# Altium schematic sheet SDEC944-xD_R‚serves_(ETOR).SchDoc: Réserves (ETOR)
size 393 x 270 mm; CompanyName: Seccom; Address1: 521, rue du capt. François Garbit; Address2: 69440 Mornant; Address3: seccom@seccom.fr; Address4: www.seccom.fr; DocumentNumber: 20; SheetNumber: 20; SheetTotal: 22; PageSetup: Record=PageOptions|CenterHorizontal=True|CenterVertical=True|PrintScale=0.74|XCorrection=1.00|YCorrection=1.00|PrintKind=0|BorderSize=5000000|LeftOffset=0|BottomOffset=0|Orientation=2|PaperLength=1000|PaperWidth=1000|Scale=100|PaperSource=7|PrintQuality=-4|MediaType=1|DitherType=10|PaperKind=A4|PrintScaleMode=1
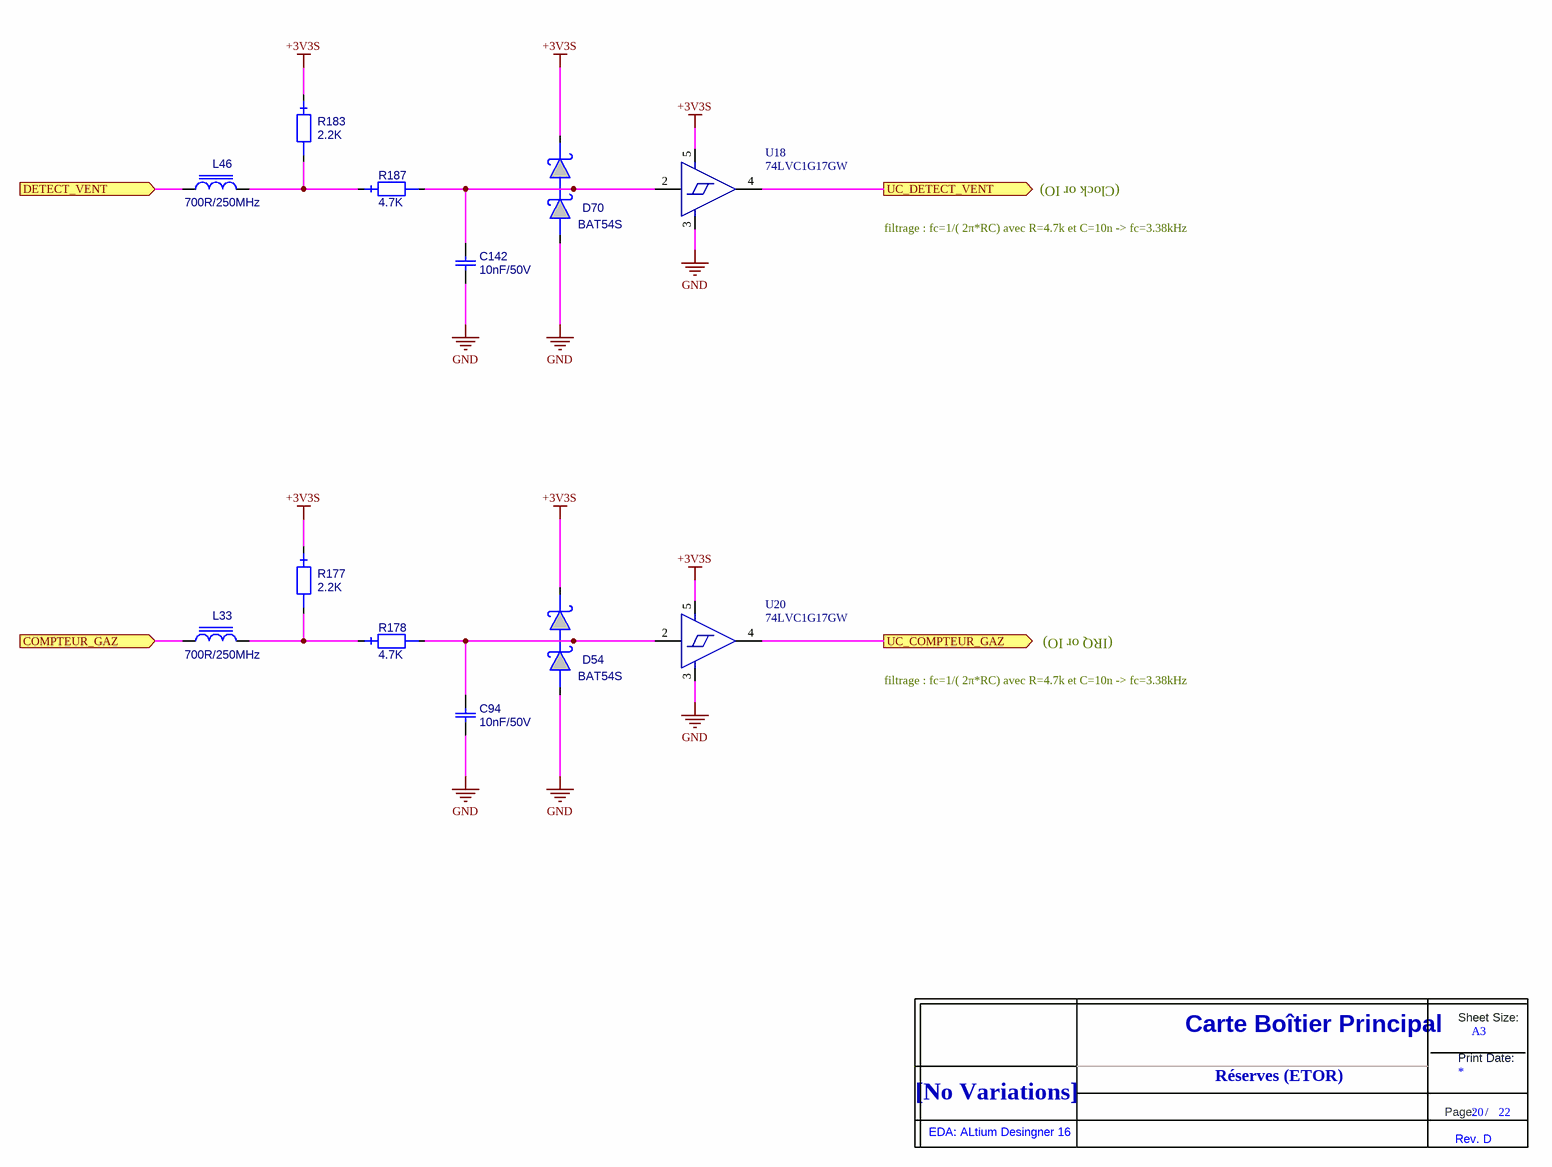
[diagram p0: SDEC944-xD_R‚serves_(ETOR).SchDoc]

## Parts
C94  value 10nF/50V  [0603_ReflowSoldering_CAP]  (hidden comment: C_0603_X7R_10%_10N-50V)
C142  value 10nF/50V  [0603_ReflowSoldering_CAP]  (hidden comment: C_0603_X7R_10%_10N-50V)
D54  BAT54S  [SOT23_3L_ReflowSoldering]
D70  BAT54S  [SOT23_3L_ReflowSoldering]
L33  value 700R/250MHz  [0603_ReflowSoldering_CAP]  (hidden comment: IND_FERRITE_0603_742792643)
L46  value 700R/250MHz  [0603_ReflowSoldering_CAP]  (hidden comment: IND_FERRITE_0603_742792643)
R177  value 2.2K  [0603_ReflowSoldering_RES]  (hidden comment: RES_0603_1%_100PPM_2.2K)
R178  value 4.7K  [0603_ReflowSoldering_RES]  (hidden comment: RES_0603_1%_100PPM_4.7K)
R183  value 2.2K  [0603_ReflowSoldering_RES]  (hidden comment: RES_0603_1%_100PPM_2.2K)
R187  value 4.7K  [0603_ReflowSoldering_RES]  (hidden comment: RES_0603_1%_100PPM_4.7K)
Title_new  DNI  (value not drawn)  (graphical)
U18  74LVC1G17GW  [SOT353]
U20  74LVC1G17GW  [SOT353]

## Ports
COMPTEUR_GAZ (in), DETECT_VENT (in), UC_COMPTEUR_GAZ (out), UC_DETECT_VENT (out)

## Nets
+3V3S: D54.2 D70.2 R177.1 R183.1 U18.5(VCC) U20.5(VCC)
GND: C94.1 C142.1 D54.1 D70.1 U18.3(VCC) U20.3(VCC)
COMPTEUR_GAZ: L33.1 ; port COMPTEUR_GAZ
DETECT_VENT: L46.1 ; port DETECT_VENT
UC_COMPTEUR_GAZ: U20.4(Y) ; port UC_COMPTEUR_GAZ
UC_DETECT_VENT: U18.4(Y) ; port UC_DETECT_VENT
NetC94_2: C94.2 D54.3 R178.2 U20.2(A)
NetC142_2: C142.2 D70.3 R187.2 U18.2(A)
NetL33_2: L33.2 R177.2 R178.1
NetL46_2: L46.2 R183.2 R187.1

Not connected (* = marked no-connect by the designer): U18 1(NC); U20 1(NC)

## Notes on the sheet
- (Clock or IO)
- filtrage : fc=1/( 2π*RC) avec R=4.7k et C=10n -> fc=3.38kHz
- (IRQ or IO)
- Réserves (ETOR)
- (in symbol Title_new) Sheet Size:; Carte Boîtier Principal; A3; Print Date:; [No Variations]; Page:; /; EDA: ALtium Desingner 16; Rev. D

## Library data of the parts
C94 C142 = C_0603_X7R_10%_10N-50V: Condensateur céramique, X7R, 10%, CMS 0603; Creation: CHD; Boitier: 0603; Remarque: {Remarque}; Coeff: 1; Fabricant: Kemet; Ref Fab: C0603C103K5RAC; ComponentLink1URL: o:\_Documentation\Datasheets\Kemet\Condos_Ceramic_CMS.pdf; ComponentLink2URL: o:\_Documentation\Datasheets\_BOITIERS\PASSIF_CMS\; Config: *; ComponentLink1Description: Datasheet; ComponentLink2Description: Datasheet Boitier; Supplier 1: Farnell; Supplier Part Number 1: 1414609
D54 D70 = BAT54S: Diode Schottky double, BAT54 en série, Vrrm=30V, If=200mA, Vf=0.4Vmax, CMS; Creation: JMP 05/09/2002; Verification: GO (26/09/02); Reference: 000206/00; Boitier: SOT23_3L; Remarque: {Remarque}; Coeff: 1; Fabricant: NXP; ComponentLink1URL: O:\_Documentation\Datasheets\NXP\BAT54_series.pdf; ComponentLink2URL: o:\_Documentation\Datasheets\_BOITIERS\ACTIF_CMS\SOT\SOT_23_3P_(Schneider).PDF; Config: *; ComponentLink1Description: Datasheet; ComponentLink2Description: Datasheet Boitier; Ref Fab: BAT54S; Supplier 1: Farnell; Supplier Part Number 1: 1081194; Value: BAT54S; Supplier 2: Mouser; Supplier Part Number 2: 771-BAT54S-T/R
L33 L46 = IND_FERRITE_0603_742792643: Inductance à ferrite multicouches CMS, imp=700R@250MHz, +/-25%, Rdc=350mR, I=400mA; Creation: PDP (02/08/12); Boitier: 0603; Coeff: 1; Fabricant: Wurth Elektronik; ComponentLink1URL: o:\_Documentation\Datasheets\Murata\Ferrite_BLM21P.pdf; Config: *; ComponentLink1Description: Datasheet; ComponentLink2Description: Datasheet Boitier; Ref Fab: 742792643; Supplier 1: Farnell; Supplier Part Number 1: 1800349
R177 R183 = RES_0603_1%_100PPM_2.2K: Résistance, 0.100W, 1%, 100ppm, 75V, 2.2K; Creation: JPL (05/07/12); Boitier: 0603; Remarque: {Remarque}; Fabricant: Vishay; Ref Fab: CRCW06032K20FKEA; Coeff: 1; Verification: *; ComponentLink1URL: O:\_Documentation\Datasheets\Vishay\Resistances_D-CRCWe3.pdf; ComponentLink2URL: o:\_Documentation\Datasheets\_BOITIERS\PASSIF_CMS\; Config: *; ComponentLink1Description: Datasheet; ComponentLink2Description: Datasheet Boitier; Supplier 1: Farnell; Supplier 2: RadioSpares; Supplier Part Number 1: 1469765; Supplier Part Number 2: 6790112
R178 R187 = RES_0603_1%_100PPM_4.7K: Résistance, 0.100W, 1%, 100ppm, 75V, 4.7K; Creation: JPL (05/07/12); Boitier: 0603; Remarque: {Remarque}; Fabricant: Vishay; Ref Fab: CRCW06034K70FKEA; Coeff: 1; Verification: *; ComponentLink1URL: O:\_Documentation\Datasheets\Vishay\Resistances_D-CRCWe3.pdf; ComponentLink2URL: o:\_Documentation\Datasheets\_BOITIERS\PASSIF_CMS\; Config: *; ComponentLink1Description: Datasheet; ComponentLink2Description: Datasheet Boitier; Supplier 1: Farnell; Supplier 2: RadioSpares; Supplier Part Number 1: 1469807; Supplier Part Number 2: 6790484
Title_new = Title_new
U18 U20 = 74LVC1G17GW,125: IC BUFFER SCHMIT TRIG SOT23-5; Manufacturer: NXP Semiconductors; Logic Type: Buffer, Non-Inverting; Number of Elements: 1; Input Type: Schmitt Trigger; Output Type: Push-Pull; Current - Output High, Low: 32mA, 32mA; Voltage - Supply: 1.65 V ~ 5.5 V; Supplier 1: Digi-Key; RoHS: RoHS Compliant; Category: Integrated Circuits (ICs); Stock 1: 36642; Pricing 1: 1=0.32, 10=0.258, 100=0.1368, 500=0.08994, 1000=0.06128 (USD); Packaging: Cut Tape (CT); Part Status: Active; Number of Bits per Element: 1; Operating Temperature: -40°C ~ 125°C (TA); Mounting Type: Surface Mount; Package / Case: 5-TSSOP, SC-70-5, SOT-353; Supplier Device Package: 5-TSSOP; ComponentLink1URL: http://www.nxp.com/documents/data_sheet/74LVC1G17.pdf; ComponentLink1Description: http://www.nxp.com/documents/data_sheet/74LVC1G17.pdf; Supplier Part Number 1: 568-4613-1-ND; Manufacturer Part Number: 74LVC1G17GW,125; Fabricant: NXP Semiconductors; Ref Fab: 74LVC1G17GW,125; Value: 74LVC1G17GW,125